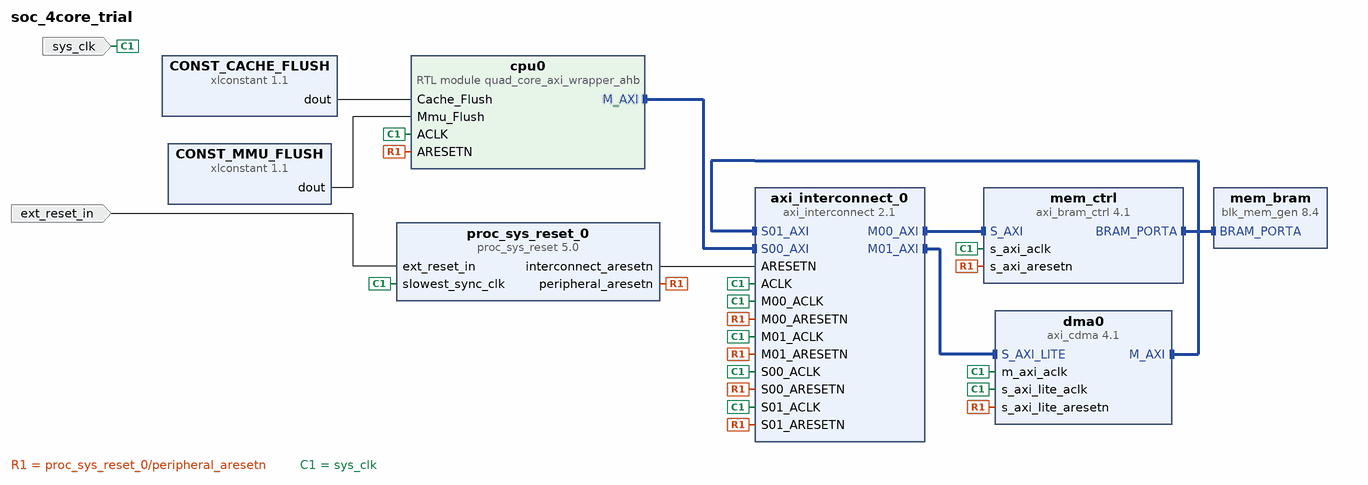
[diagram p0: block diagram of the top level]
# Vivado block design soc_4core_trial, xc7z030fbv676-1, Vivado 2022.2
create_bd_design soc_4core_trial

create_bd_port -dir I ext_reset_in
create_bd_port -dir I -type clk sys_clk
set_property -dict {CONFIG.FREQ_HZ 100000000} [get_bd_ports sys_clk]

create_bd_cell -type ip -vlnv xilinx.com:ip:proc_sys_reset:5.0 proc_sys_reset_0
create_bd_cell -type module -reference quad_core_axi_wrapper_ahb cpu0
set_property -dict [list \
  CONFIG.RESET_ADDR0 0x00001000 \
  CONFIG.RESET_ADDR1 0x00002000 \
  CONFIG.RESET_ADDR2 0x00003000 \
  CONFIG.RESET_ADDR3 0x00004000 \
] [get_bd_cells cpu0]
create_bd_cell -type ip -vlnv xilinx.com:ip:xlconstant:1.1 CONST_MMU_FLUSH
set_property -dict {CONFIG.CONST_VAL 0 CONFIG.CONST_WIDTH 1} [get_bd_cells CONST_MMU_FLUSH]
create_bd_cell -type ip -vlnv xilinx.com:ip:xlconstant:1.1 CONST_CACHE_FLUSH
set_property -dict {CONFIG.CONST_VAL 0 CONFIG.CONST_WIDTH 1} [get_bd_cells CONST_CACHE_FLUSH]
create_bd_cell -type ip -vlnv xilinx.com:ip:axi_cdma:4.1 dma0
set_property -dict {CONFIG.C_INCLUDE_SG 0} [get_bd_cells dma0]
create_bd_cell -type ip -vlnv xilinx.com:ip:axi_bram_ctrl:4.1 mem_ctrl
set_property -dict {CONFIG.PROTOCOL AXI4 CONFIG.SINGLE_PORT_BRAM 1} [get_bd_cells mem_ctrl]
create_bd_cell -type ip -vlnv xilinx.com:ip:blk_mem_gen:8.4 mem_bram
set_property -dict {CONFIG.Memory_Type Single_Port_RAM CONFIG.Write_Width_A 32} [get_bd_cells mem_bram]
create_bd_cell -type ip -vlnv xilinx.com:ip:axi_interconnect:2.1 axi_interconnect_0
set_property -dict {CONFIG.NUM_MI 2 CONFIG.NUM_SI 2} [get_bd_cells axi_interconnect_0]

# ---- connections ----

connect_bd_intf_net [get_bd_intf_pins axi_interconnect_0/M00_AXI] [get_bd_intf_pins mem_ctrl/S_AXI]
connect_bd_intf_net [get_bd_intf_pins axi_interconnect_0/M01_AXI] [get_bd_intf_pins dma0/S_AXI_LITE]
connect_bd_intf_net [get_bd_intf_pins cpu0/M_AXI] [get_bd_intf_pins axi_interconnect_0/S00_AXI]
connect_bd_intf_net [get_bd_intf_pins dma0/M_AXI] [get_bd_intf_pins axi_interconnect_0/S01_AXI]
connect_bd_intf_net [get_bd_intf_pins mem_ctrl/BRAM_PORTA] [get_bd_intf_pins mem_bram/BRAM_PORTA]
connect_bd_net [get_bd_pins CONST_CACHE_FLUSH/dout] [get_bd_pins cpu0/Cache_Flush]
connect_bd_net [get_bd_pins CONST_MMU_FLUSH/dout] [get_bd_pins cpu0/Mmu_Flush]
connect_bd_net [get_bd_ports ext_reset_in] [get_bd_pins proc_sys_reset_0/ext_reset_in]
connect_bd_net [get_bd_pins proc_sys_reset_0/interconnect_aresetn] [get_bd_pins axi_interconnect_0/ARESETN]
connect_bd_net [get_bd_pins proc_sys_reset_0/peripheral_aresetn] \
  [get_bd_pins cpu0/ARESETN] [get_bd_pins dma0/s_axi_lite_aresetn] [get_bd_pins mem_ctrl/s_axi_aresetn] \
  [get_bd_pins axi_interconnect_0/S00_ARESETN] [get_bd_pins axi_interconnect_0/M00_ARESETN] \
  [get_bd_pins axi_interconnect_0/S01_ARESETN] [get_bd_pins axi_interconnect_0/M01_ARESETN]
connect_bd_net [get_bd_ports sys_clk] \
  [get_bd_pins proc_sys_reset_0/slowest_sync_clk] [get_bd_pins cpu0/ACLK] [get_bd_pins dma0/s_axi_lite_aclk] \
  [get_bd_pins dma0/m_axi_aclk] [get_bd_pins mem_ctrl/s_axi_aclk] [get_bd_pins axi_interconnect_0/ACLK] \
  [get_bd_pins axi_interconnect_0/S00_ACLK] [get_bd_pins axi_interconnect_0/M00_ACLK] \
  [get_bd_pins axi_interconnect_0/S01_ACLK] [get_bd_pins axi_interconnect_0/M01_ACLK]

# ---- address map ----
assign_bd_address -offset 0x00000000 -range 256K -target_address_space [get_bd_addr_spaces cpu0/M_AXI] [get_bd_addr_segs mem_ctrl/S_AXI/Mem0]
assign_bd_address -offset 0x44A00000 -range 64K -target_address_space [get_bd_addr_spaces cpu0/M_AXI] [get_bd_addr_segs dma0/S_AXI_LITE/Reg]
assign_bd_address -offset 0xC0000000 -range 8K -target_address_space [get_bd_addr_spaces dma0/Data] [get_bd_addr_segs mem_ctrl/S_AXI/Mem0]
exclude_bd_addr_seg -offset 0x44A00000 -range 64K -target_address_space [get_bd_addr_spaces dma0/Data] [get_bd_addr_segs dma0/S_AXI_LITE/Reg]

validate_bd_design
save_bd_design
